# EAGLE schematic MEP-Úkol-4 (EAGLE 9.6.2)
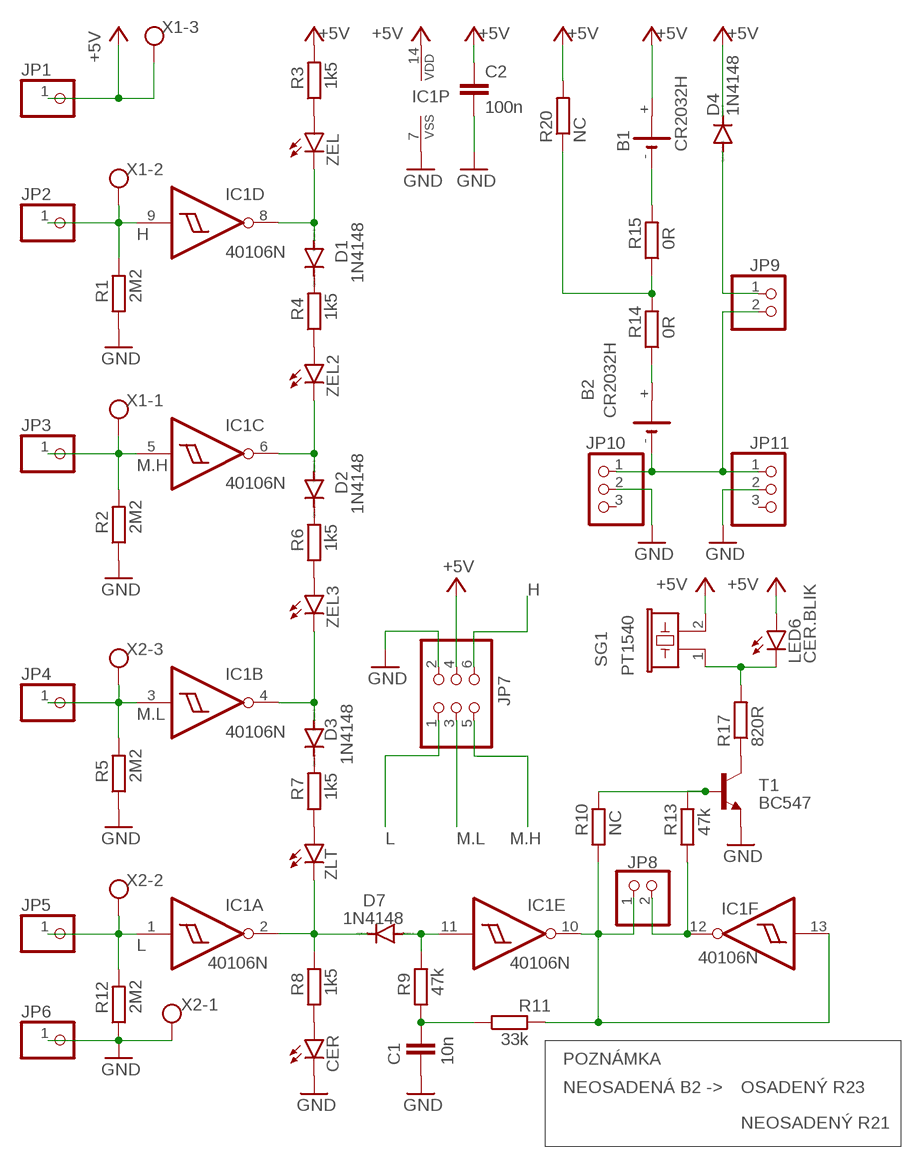
[diagram p0: schematic, sheet 1]

## Parts
B1  CR2032H  [CR2032H]
B2  CR2032H  [CR2032H]
C1  10n  C-EUC0805  [C0805]
C2  100n  C-EUC0805  [C0805]
CER  LEDCHIP-LED0805  [CHIP-LED0805]
D1  1N4148  1N4148DO35-7  [DO35-7]
D2  1N4148  1N4148DO35-7  [DO35-7]
D3  1N4148  1N4148DO35-7  [DO35-7]
D4  1N4148  1N4148DO35-7  [DO35-7]
D7  1N4148  1N4148DO35-7  [DO35-7]
IC1  40106N  [DIL14]
JP1  PINHD-1X1  [1X01]
JP2  PINHD-1X1  [1X01]
JP3  PINHD-1X1  [1X01]
JP4  PINHD-1X1  [1X01]
JP5  PINHD-1X1  [1X01]
JP6  PINHD-1X1  [1X01]
JP7  PINHD-2X3  [2X03]
JP8  PINHD-1X2  [1X02]
JP9  PINHD-1X2  [1X02]
JP10  PINHD-1X3  [1X03]
JP11  PINHD-1X3  [1X03]
LED6  CER.BLIK  LEDCHIP-LED0805  [CHIP-LED0805]
R1  2M2  R-EU_R0805  [R0805]
R2  2M2  R-EU_R0805  [R0805]
R3  1k5  R-EU_R0805  [R0805]
R4  1k5  R-EU_R0805  [R0805]
R5  2M2  R-EU_R0805  [R0805]
R6  1k5  R-EU_R0805  [R0805]
R7  1k5  R-EU_R0805  [R0805]
R8  1k5  R-EU_R0805  [R0805]
R9  47k  R-EU_R0805  [R0805]
R10  NC  R-EU_R0805  [R0805]
R11  33k  R-EU_R0805  [R0805]
R12  2M2  R-EU_R0805  [R0805]
R13  47k  R-EU_R0805  [R0805]
R14  0R  R-EU_R0805  [R0805]
R15  0R  R-EU_R0805  [R0805]
R17  820R  R-EU_R0805  [R0805]
R20  NC  R-EU_R0805  [R0805]
SG1  PT1540  EFBRD22C41  [EFBRD22C41]
T1  BC547  BC847-NPN-SOT23-BEC  [SOT23-BEC]
X1  AK500/3  [AK500/3]
X2  AK500/3  [AK500/3]
ZEL  LEDCHIP-LED0805  [CHIP-LED0805]
ZEL2  LEDCHIP-LED0805  [CHIP-LED0805]
ZEL3  LEDCHIP-LED0805  [CHIP-LED0805]
ZLT  LEDCHIP-LED0805  [CHIP-LED0805]

## Nets
+5V: B1.+ C2.1 D4.C IC1.14(P:VDD) JP1.1 JP7.4 LED6.A R3.2 R20.2 SG1.2 X1.3
GND: C1.2 C2.2 CER.C IC1.7(P:VSS) JP6.1 JP7.2 JP10.2 JP11.2 R1.1 R2.1 R5.1 R12.1 T1.E X2.1
H: IC1.9(D:I) JP2.1 JP7.6 R1.2 X1.2
L: IC1.1(A:I) JP5.1 JP7.1 R12.2 X2.2
M.H: IC1.5(C:I) JP3.1 JP7.5 R2.2 X1.1
M.L: IC1.3(B:I) JP4.1 JP7.3 R5.2 X2.3
N$1: R3.1 ZEL.A
N$2: R4.1 ZEL2.A
N$3: D2.C R6.2
N$4: R6.1 ZEL3.A
N$5: R7.1 ZLT.A
N$6: CER.A R8.1
N$7: IC1.10(E:O) IC1.13(F:I) JP8.1 R10.1 R11.2
N$8: D1.C R4.2
N$9: D1.A IC1.8(D:O) ZEL.C
N$10: D2.A IC1.6(C:O) ZEL2.C
N$11: IC1.12(F:O) JP8.2 R13.1
N$12: R10.2 R13.2 T1.B
N$13: D3.A IC1.4(B:O) ZEL3.C
N$14: R17.1 T1.C
N$15: D3.C R7.2
N$16: LED6.C R17.2 SG1.1
N$17: D7.C IC1.2(A:O) R8.2 ZLT.C
N$18: B2.- JP9.2 JP10.1 JP11.1
N$19: D7.A IC1.11(E:I) R9.2
N$20: C1.1 R9.1 R11.1
N$21: B2.+ R14.1
N$22: R14.2 R15.1 R20.1
N$23: B1.- R15.2
N$24: D4.A JP9.1
Unconnected: B1.+@1(+) B2.+@1(+) JP10.3 JP11.3

## Notes on the sheet
- POZNÁMKA
- NEOSADENÁ B2 -> | OSADENÝ R23
- NEOSADENÝ R21

## Library data of the parts
B1 B2 = battery:CR2032H: LI BATTERY Varta
C1 C2 = rcl:C-EU: CAPACITOR, European symbol; SPICEPREFIX: C
CER LED6 ZEL ZEL2 ZEL3 ZLT = led:LED: LED OSRAM: - CHIPLED LG R971, LG N971, LY N971, LG Q971, LY Q971, LO R971, LY R971 LH N974, LH R974 LS Q976, LO Q976, LY Q976 LO Q996 - Hyper CHIPLED LW Q18S LB Q993, LB Q99A, LB R99A - SideLED LS A670, LO A670, LY A670, LG A670, LP A670 LB A673, LV A673, LT A673, LW A673 LH A674 LY A675 LS A676, LA A676, LO A676, LY A676, LW A676 LS A679, LY A679, LG A679 - Hyper Micro SIDELED® LS Y876, LA Y876, LO Y876, LY Y876 LT Y87S - SmartLED LW L88C, LW L88S LB L89C, LB L89S, LG L890 LS L89K, LO L89K, LY L89K LS L896, LA L896, LO L896, LY L896 - TOPLED LS T670, LO T670, LY T670, LG T670, LP T670 LSG T670, LSP T670, LSY T670, LOP T670, LYG T670 LG T671, LOG T671, LSG T671 LB T673, LV T673, LT T673, LW T673 LH T674 LS T676, LA T676, LO T676, LY T676, LB T676, LH T676, LSB T676, LW T676 LB T67C, LV T67C, LT T67C, LS T67K, LO T67K, LY T67K, LW E67C LS E67B, LA E67B, LO E67B, LY E67B, LB E67C, LV E67C, LT E67C LW T67C LS T679, LY T679, LG T679 LS T770, LO T770, LY T770, LG T770, LP T770 LB T773, LV T773, LT T773, LW T773 LH T774 LS E675, LA E675, LY E675, LS T675 LS T776, LA T776, LO T776, LY T776, LB T776 LHGB T686 LT T68C, LB T68C - Hyper Mini TOPLED® LB M676 - Mini TOPLED Santana® LG M470 LS M47K, LO M47K, LY M47K Source: http://www.osram.convergy.de LUXEON: - LUMILED® LXK2-PW12-R00, LXK2-PW12-S00, LXK2-PW14-U00, LXK2-PW14-V00 LXK2-PM12-R00, LXK2-PM12-S00, LXK2-PM14-U00 LXK2-PE12-Q00, LXK2-PE12-R00, LXK2-PE12-S00, LXK2-PE14-T00, LXK2-PE14-U00 LXK2-PB12-K00, LXK2-PB12-L00, LXK2-PB12-M00, LXK2-PB14-N00, LXK2-PB14-P00, LXK2-PB14-Q00 LXK2-PR12-L00, LXK2-PR12-M00, LXK2-PR14-Q00, LXK2-PR14-R00 LXK2-PD12-Q00, LXK2-PD12-R00, LXK2-PD12-S00 LXK2-PH12-R00, LXK2-PH12-S00 LXK2-PL12-P00, LXK2-PL12-Q00, LXK2-PL12-R00 Source: www.luxeon.com KINGBRIGHT: KA-3528ASYC Source: www.kingbright.com
D1-D4 D7 = diode:1N4148: DIODE high speed (Philips)
IC1 = 40xx:40106: Hex SCHMITT TRIGGER
JP1-JP6 = pinhead:PINHD-1X1: PIN HEADER
JP7 = pinhead:PINHD-2X3: PIN HEADER
JP8 JP9 = pinhead:PINHD-1X2: PIN HEADER
JP10 JP11 = pinhead:PINHD-1X3: PIN HEADER
R1-R15 R17 R20 = rcl:R-EU_: RESISTOR, European symbol; SPICEPREFIX: R
SG1 = buzzer:EFB?: Piezoelectric Acoustic Transducer Source: Panbasonic .. 2SC1685.pdf; OC_FARNELL: unknown; OC_NEWARK: unknown
T1 = transistor:*-NPN-: NPN Transistror BF959 corrected 2008.03.06
X1 X2 = con-ptr500:AK500/3: CONNECTOR; OC_FARNELL: unknown; OC_NEWARK: unknown